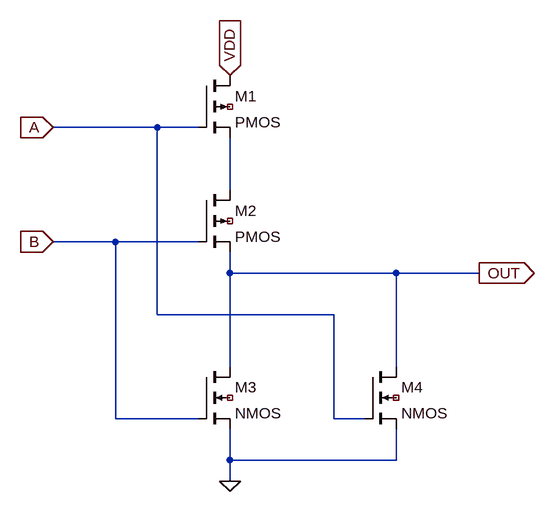
[diagram p0: schematic cmos_nor.asc]
cmos_nor.asc, the LTspice schematic file:
Version 4
SHEET 1 880 788
WIRE -1744 224 -1904 224
WIRE -1680 224 -1744 224
WIRE -1632 320 -1632 240
WIRE -1808 400 -1904 400
WIRE -1680 400 -1808 400
WIRE -1632 448 -1632 416
WIRE -1376 448 -1632 448
WIRE -1248 448 -1376 448
WIRE -1744 512 -1744 224
WIRE -1472 512 -1744 512
WIRE -1632 592 -1632 448
WIRE -1376 592 -1376 448
WIRE -1808 672 -1808 400
WIRE -1680 672 -1808 672
WIRE -1472 672 -1472 512
WIRE -1424 672 -1472 672
WIRE -1632 736 -1632 688
WIRE -1376 736 -1376 688
WIRE -1376 736 -1632 736
WIRE -1632 768 -1632 736
FLAG -1632 144 VDD
IOPIN -1632 144 In
FLAG -1904 224 A
IOPIN -1904 224 In
FLAG -1904 400 B
IOPIN -1904 400 In
FLAG -1248 448 OUT
IOPIN -1248 448 Out
FLAG -1632 768 0
SYMBOL pmos4 -1680 320 R0
SYMATTR InstName M2
SYMBOL pmos4 -1680 144 R0
SYMATTR InstName M1
SYMBOL nmos4 -1680 592 R0
SYMATTR InstName M3
SYMBOL nmos4 -1424 592 R0
SYMATTR InstName M4

The netlist it stands for:
* cmos_nor.asc
M2 N001 B OUT NC_01 PMOS
M1 VDD A N001 NC_02 PMOS
M3 OUT B 0 NC_03 NMOS
M4 OUT A 0 NC_04 NMOS
.model NMOS NMOS
.model PMOS PMOS
.lib standard.mos
.backanno
.end